# Altium schematic sheet Main.SchDoc
size A; SheetNumber: 3; SheetTotal: 5
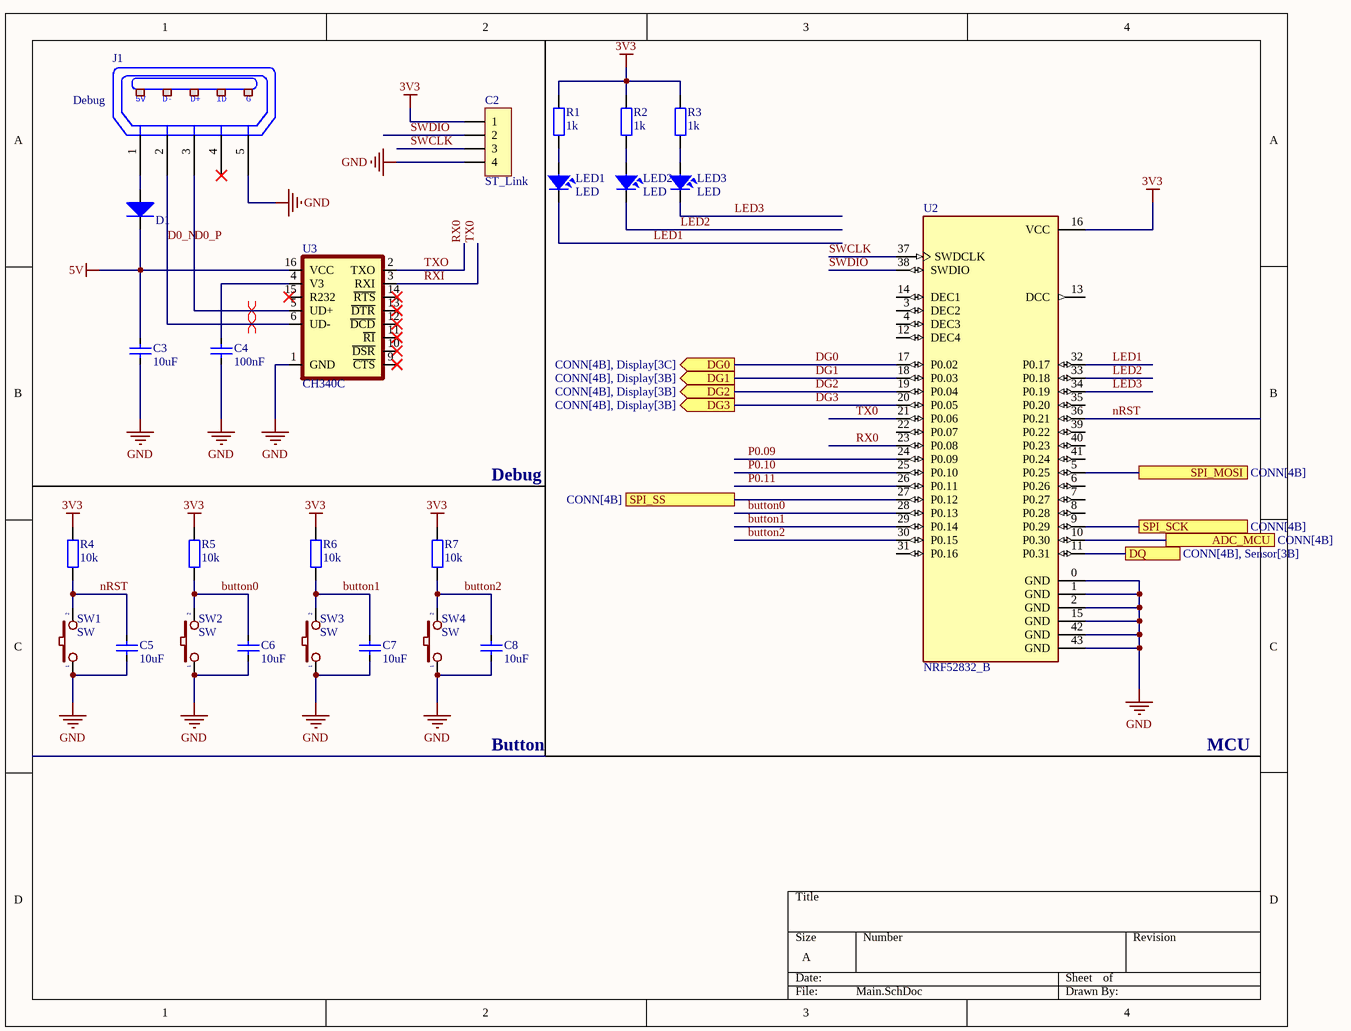
[diagram p0: Main.SchDoc]

## Parts
C2  ST_Link  [J4-D1T]
C3  10uF  [CAP_0805]
C4  100nF  [CAP_0805]
C5  10uF  [CAP_0805]
C6  10uF  [CAP_0805]
C7  10uF  [CAP_0805]
C8  10uF  [CAP_0805]
D1  Diode SMD  [DIO-214AC(SMA)]  (value not drawn)
J1  Debug  [USB-M1]
LED1  LED  [LED-0805-Red]
LED2  LED  [LED-0805-Yellow]
LED3  LED  [LED-0805-Green]
R1  1k  [RES-SMD-0805]
R2  1k  [RES-SMD-0805]
R3  1k  [RES-SMD-0805]
R4  10k  [RES-SMD-0805]
R5  10k  [RES-SMD-0805]
R6  10k  [RES-SMD-0805]
R7  10k  [RES-SMD-0805]
SW1  SW  [SW 3x2x4]
SW2  SW  [SW2]
SW3  SW  [SW2]
SW4  SW  [SW2]
U2  NRF52832_B  [NRF52832_B]
U3  CH340C  [SOP-16]

## Ports
ADC_MCU (see CONN[4B]), DG0 (out, see CONN[4B], Display[3C]), DG1 (out, see CONN[4B], Display[3B]), DG2 (out, see CONN[4B], Display[3B]), DG3 (out, see CONN[4B], Display[3B]), DQ (see CONN[4B], Sensor[3B]), SPI_MOSI (see CONN[4B]), SPI_SCK (see CONN[4B]), SPI_SS (see CONN[4B])

## Nets
3V3: C2.1 R1.1 R2.1 R3.1 R4.1 R5.1 R6.1 R7.1 U2.16(VCC)
5V: C3.2 D1.2(K) U3.16(VCC)
GND: C2.4 C3.1 C4.1 C5.1 C6.1 C7.1 C8.1 J1.5(P5) SW1.1 SW2.1 SW3.1 SW4.1 U2.0(GND) U2.1(GND) U2.2(GND) U2.15(GND) U2.42(GND) U2.43(GND) U3.1(GND)
ADC_MCU: U2.10(P0.30) ; port ADC_MCU
button0: C6.2 R5.2 SW2.2 U2.28(P0.13)
button1: C7.2 R6.2 SW3.2 U2.29(P0.14)
button2: C8.2 R7.2 SW4.2 U2.30(P0.15)
D0_N: J1.2(P2) U3.6(UD-)
D0_P: J1.3(P3) U3.5(UD+)
DG0: U2.17(P0.02) ; port DG0
DG1: U2.18(P0.03) ; port DG1
DG2: U2.19(P0.04) ; port DG2
DG3: U2.20(P0.05) ; port DG3
DQ: U2.11(P0.31) ; port DQ
LED1: LED1.2 U2.32(P0.17)
LED2: LED2.2 U2.33(P0.18)
LED3: LED3.2 U2.34(P0.19)
nRST: C5.2 R4.2 SW1.2 U2.36(P0.21)
P0.09: U2.24(P0.09)
P0.10: U2.25(P0.10)
P0.11: U2.26(P0.11)
RX0: U2.23(P0.08) U3.2(TXO)  [also labelled TXO]
RXI: U2.21(P0.06) U3.3(RXI)  [also labelled TX0]
SPI_MOSI: U2.5(P0.25) ; port SPI_MOSI
SPI_SCK: U2.9(P0.29) ; port SPI_SCK
SPI_SS: U2.27(P0.12) ; port SPI_SS
SWCLK: C2.3 U2.37(SWDCLK)
SWDIO: C2.2 U2.38(SWDIO)
NetC4_2: C4.2 U3.4(V3)
NetD1_1: D1.1(A) J1.1(P1)
NetLED1_1: LED1.1 R1.2
NetLED2_1: LED2.1 R2.2
NetLED3_1: LED3.1 R3.2

Not connected (* = marked no-connect by the designer): J1 4(P4)*; U2 3(DEC2) 4(DEC3) 6(P0.26) 7(P0.27) 8(P0.28) 12(DEC4) 13(DCC) 14(DEC1) 22(P0.07) 31(P0.16) 35(P0.20) 39(P0.22) 40(P0.23) 41(P0.24); U3 9(~{CTS})* 10(~{DSR})* 11(~{RI})* 12(~{DCD})* 13(~{DTR})* 14(~{RTS})* 15(R232)*

## Layout directives
differential pair: D0_N, D0_P

## Notes on the sheet
- Debug
- Button
- MCU
- (in symbol USB-5) 5V; D-; D+; ID; G

## Library data of the parts
C2 = JP4x1-2.0: WR-PHD 2.00 mm Socket Header; Manufacturer: W¨¹rth Elektronik eiSos GmbH; partNo: 62000411821; ComponentLink1 Description: Manufacturer; ComponentLink2 Description: Datasheet; NoPins: 04; Created Date: 2 April 2013; ComponentLink1URL: http://www.we-online.com; ComponentLink2URL: http://katalog.we-online.de/em/datasheet/6200xx11821.pdf; Created by: Karrer Zheng
C3-C8 = CapSMD: Capacitor; Value: 33p; Published: 8-Jun-2000; LatestRevisionDate: 17-Jul-2002; LatestRevisionNote: Re-released for DXP Platform.; PackageReference: RAD-0.3; Publisher: Altium Limited
D1 = Diode SMD: Default Diode; Code - JEDEC: DO-214-AB; Value: 1N5007; Published: 8-Jun-2000; Revision: July-2002: Re-released for DXP Platform.; Publisher: Altium Limited
J1 = USB-5: Manufacturer: FCI; Manufacturer Part Number: 10118193-0001LF; Connector Type: USB - micro B; Number of Contacts: 5; Gender: Receptacle; Specifications: USB 2.0; .Creator: MM; .Checked PCB: RF; Supplier 1: Digi-Key; RoHS: RoHS Compliant; Category: Connectors, Interconnects; Stock 1: 28642; Pricing 1: 1=0.46, 10=0.433, 25=0.3712, 50=0.3156, 100=0.3032, 250=0.27224, 500=0.25988 (USD); Packaging: Cut Tape (CT); Mounting Type: Surface Mount, Right Angle, Horizontal; Features: Shielded, Solder Retention; Ingress Protection: -; ComponentLink1URL: http://portal.fciconnect.com/Comergent//fci/drawing/10118193.pdf; ComponentLink1Description: http://portal.fciconnect.com/Comergent//fci/drawing/10118193.pdf; Supplier Part Number 1: 609-4616-1-ND; .Checked SCH: MM
LED1-LED3 = LED: LED Single colour Green and Red; Value: LED 3 ly Single Colour
R1-R7 = Resistor - SMD: Resistor SMD; Manufacturer: Generic Components; Class: Passive; Published: 08/06/2000; Publisher: Altium Hobart Technology Centre
SW1-SW4 = SW2: Switch button 2 pin; Value: SW chip 2 pin
U2 = NRF52832_B: https://www.ebyte.com/product-view-news.aspx?id=239&=ds-tm
U3 = CH340C: USB to serial chip CH340; MF: WCH; Package: Package; Check_prices: https://www.snapeda.com/parts/CH340C/WCH/view-part/5428851/?ref=eda; Value: *; Price: None; MP: CH340C; Availability: Unavailable; SnapEDA_Link: https://www.snapeda.com/parts/CH340C/WCH/view-part/5428851/?ref=snap